# Altium schematic sheet 16. SOC MCU OSPI0 FLASH.SchDoc: SOC - MCU OSPI FLASH
size 513 x 386 mm; Project: PROC154E2(001)_SK_AM69; Issue: 1.0; RevCode: E3; Page Create Date: March  8, 1995; Variant Name: Core Design; Schematic Page Number: 16; Page Number: 16; Page Size: C; Comment: MISTRAL_TITLEBLK_CSIZE_1; Page Count: 62; Schematic Page Count: 62; Name: PROC154E2 001 SK AM69; DsnPath: C:\Users\danie\Downloads\sprr466c\PROC154E3_RP\PROC154E3_SCH.DSN; SchematicName: SCHEMATIC1; PageName: 16. SOC MCU OSPI0 FLASH; PageSize: C; TopSchematic: True
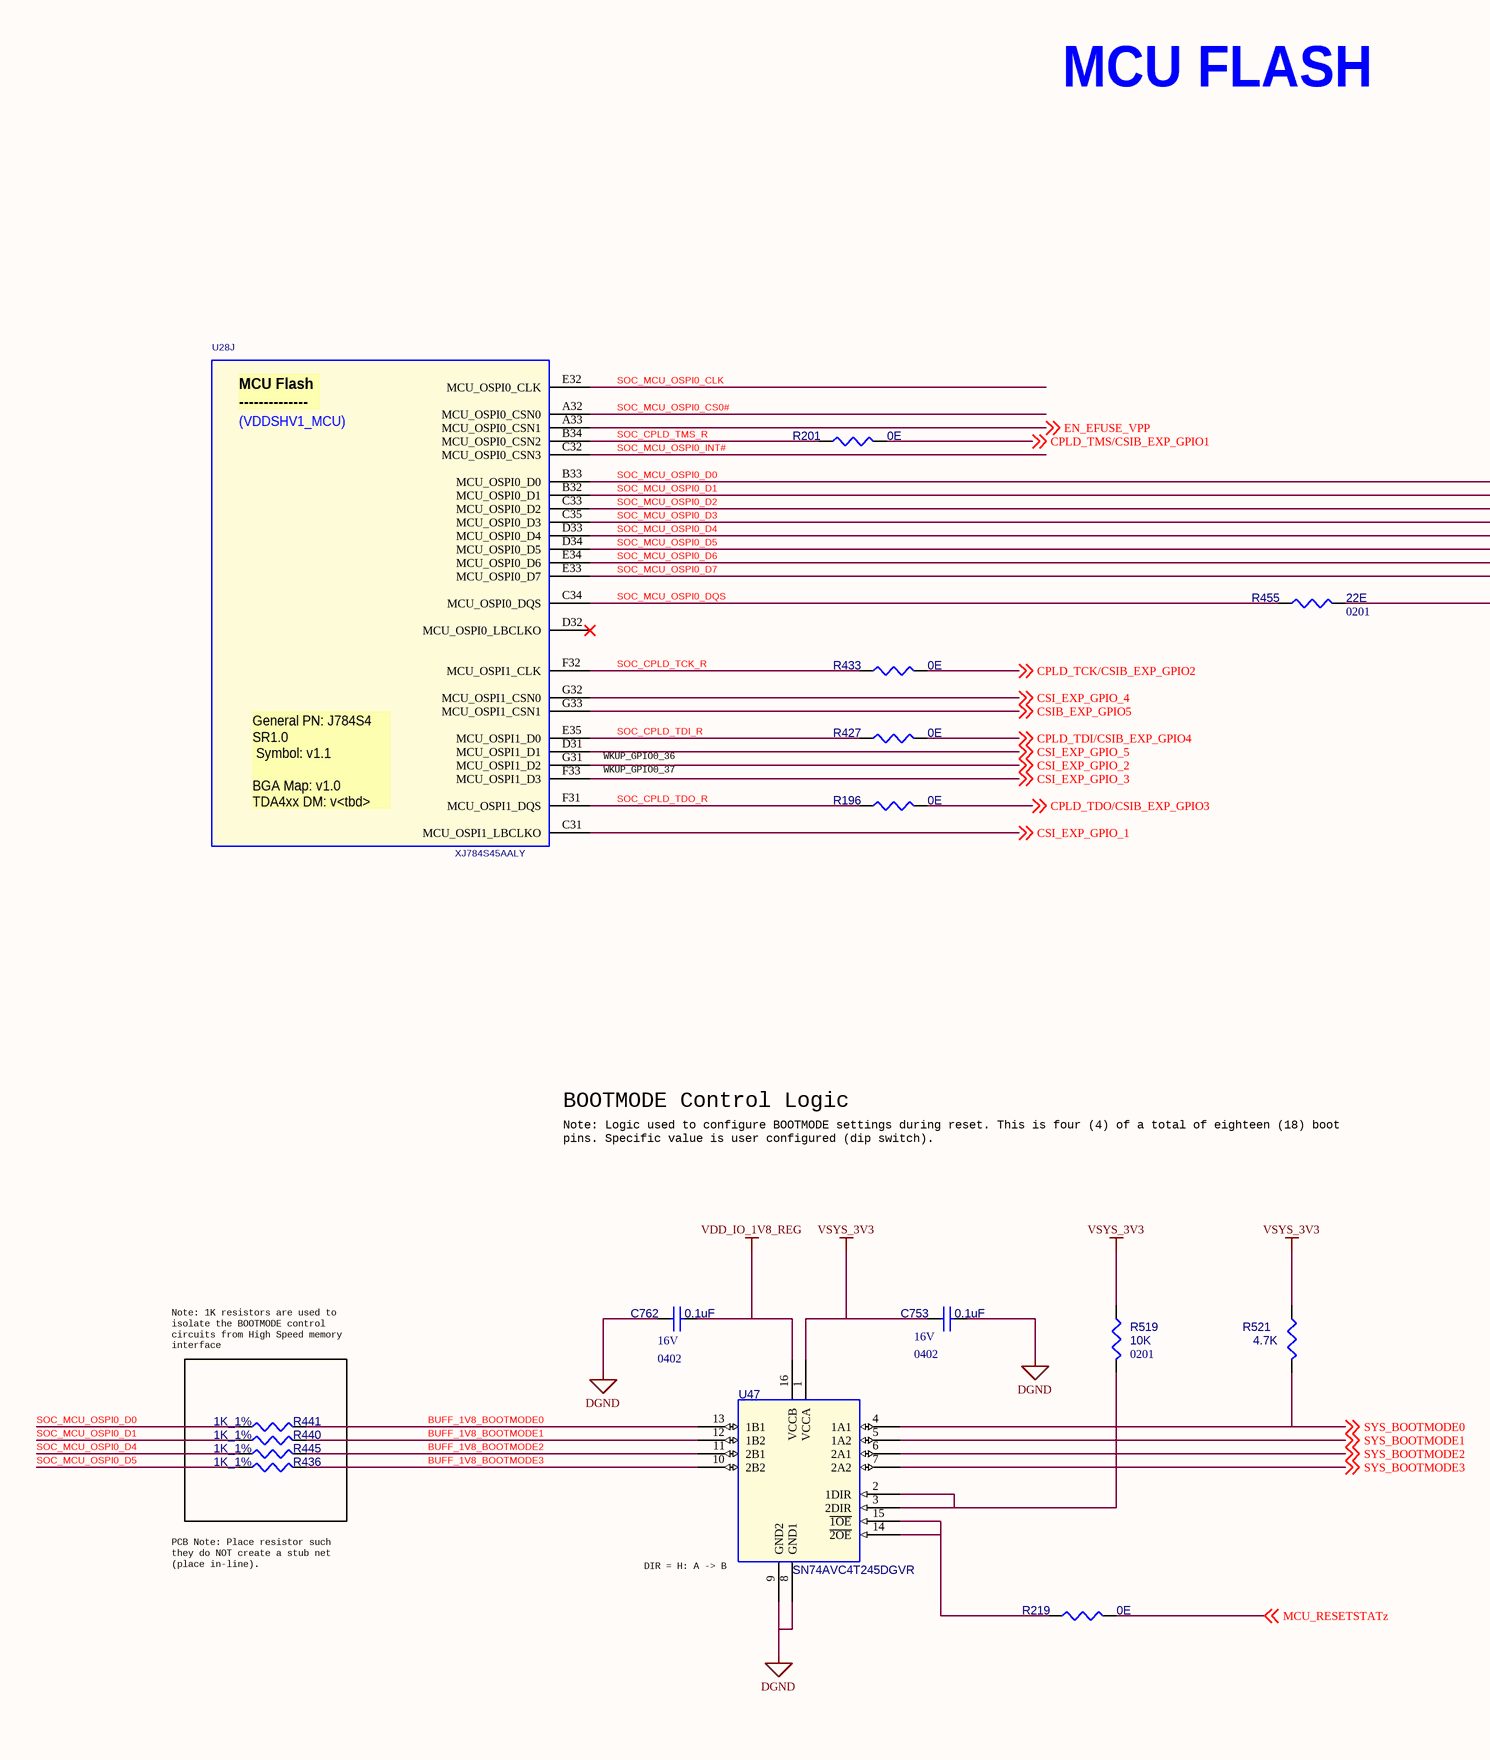
[diagram p0: 16. SOC MCU OSPI0 FLASH.SchDoc, left]
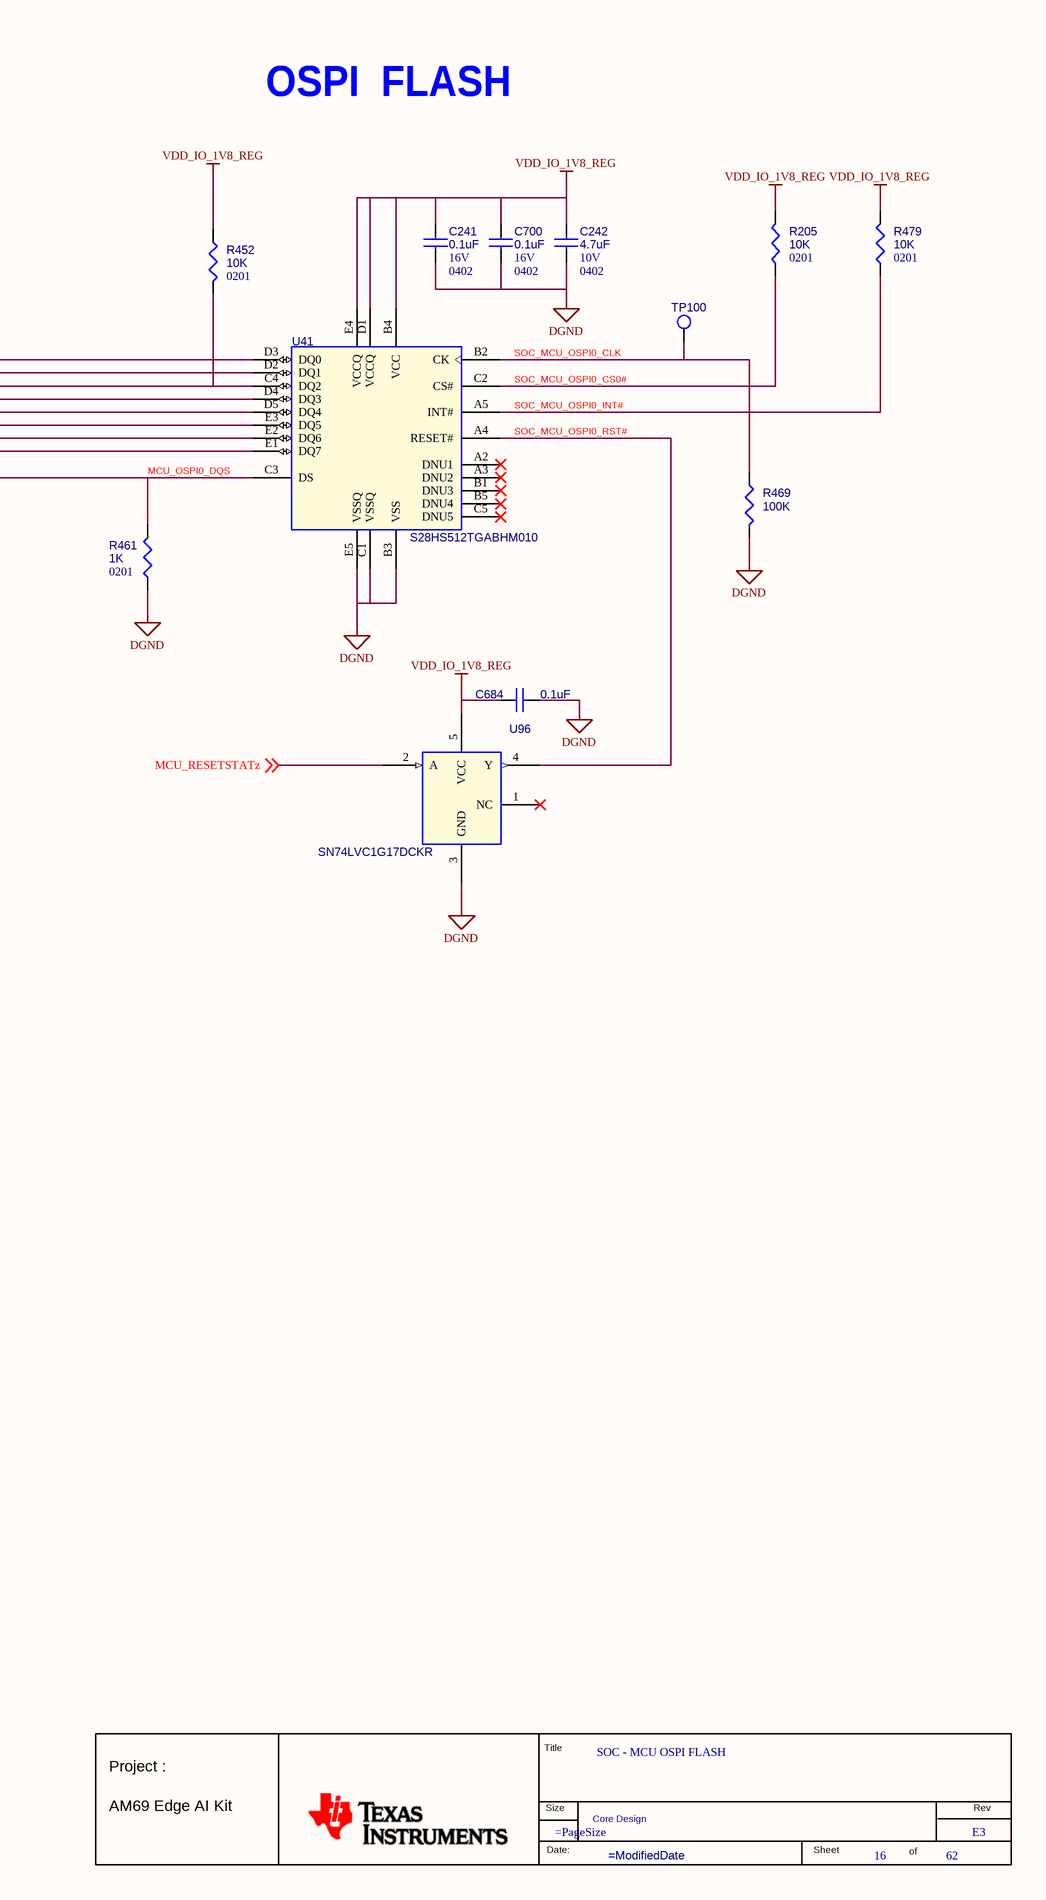
[diagram p1: 16. SOC MCU OSPI0 FLASH.SchDoc, right]

## Parts
*  RevCode: E3  Title: SOC - MCU OSPI FLASH  Page Number: 16  Page Count: 62  Variant Name: Core Design  (hidden comment: MISTRAL_TITLEBLK_CSIZE_1)  (graphical)
C241  0.1uF  Package: 0402  Voltage: 16V  [CAP0402_0-75]
C242  4.7uF  Voltage: 10V  Package: 0402  [CAP0402_0-75]
C684  0.1uF  [CAP0201_0-5]
C700  0.1uF  Voltage: 16V  Package: 0402  [CAP0402_0-75]
C753  0.1uF  Package: 0402  Voltage: 16V  [CAP0402_0-75]
C762  0.1uF  Package: 0402  Voltage: 16V  [CAP0402_0-75]
R196  0E  [RES0402_0-5]
R201  0E  [RES0402_0-5]
R205  10K  Package: 0201  [RES0201_0-5]
R219  0E  [RES0402_0-5]
R427  0E  [RES0402_0-5]
R433  0E  [RES0402_0-5]
R436  1K_1%  [RES0201_0-5]
R440  1K_1%  [RES0201_0-5]
R441  1K_1%  [RES0201_0-5]
R445  1K_1%  [RES0201_0-5]
R452  10K  Package: 0201  [RES0201_0-5]
R455  22E  Package: 0201  [RES0201_0-5]
R461  1K  Package: 0201  [RES0201_0-5]
R469  100K  [RES0402_0-5]
R479  10K  Package: 0201  [RES0201_0-5]
R519  10K  Package: 0201  [RES0201_0-5]
R521  4.7K  [RES0201_0-5]
TP100  TP30_SMD  [TP30_SMD]  (value not drawn)
U28  XJ784S45AALY  [BGA1414_31-49_1230X1230_2-7]  (part J of 26)
U41  S28HS512TGABHM010  [BGA24_39-37_240X310_1]
U47  SN74AVC4T245DGVR  [TVSOP16_15-74_150X180]
U96  SN74LVC1G17DCKR  [SC70-5]

## Nets
DGND: C241.2 C242.2 C684.2 C700.2 C753.2 C762.1 R461.1 R469.2 U41.B3(VSS) U41.C1(VSSQ) U41.E5(VSSQ) U47.8(GND1) U47.9(GND2) U96.3(GND)
VDD_IO_1V8_REG: C241.1 C242.1 C684.1 C700.1 C762.2 R205.2 R452.1 R479.2 U41.B4(VCC) U41.D1(VCCQ) U41.E4(VCCQ) U47.16(VCCB) U96.5(VCC)
VSYS_3V3: C753.1 R519.1 R521.2 U47.1(VCCA)
BUFF_1V8_BOOTMODE0: R441.1 U47.13(1B1)
BUFF_1V8_BOOTMODE1: R440.1 U47.12(1B2)
BUFF_1V8_BOOTMODE2: R445.1 U47.11(2B1)
BUFF_1V8_BOOTMODE3: R436.1 U47.10(2B2)
CPLD_TCK/CSIB_EXP_GPIO2: R433.2 ; off-sheet CPLD_TCK/CSIB_EXP_GPIO2
CPLD_TDI/CSIB_EXP_GPIO4: R427.2 ; off-sheet CPLD_TDI/CSIB_EXP_GPIO4
CPLD_TDO/CSIB_EXP_GPIO3: R196.2 ; off-sheet CPLD_TDO/CSIB_EXP_GPIO3
CPLD_TMS/CSIB_EXP_GPIO1: R201.2 ; off-sheet CPLD_TMS/CSIB_EXP_GPIO1
CSI_EXP_GPIO_1: U28.C31(MCU_OSPI1_LBCLKO) ; off-sheet CSI_EXP_GPIO_1
CSI_EXP_GPIO_2: U28.G31(MCU_OSPI1_D2) ; off-sheet CSI_EXP_GPIO_2
CSI_EXP_GPIO_3: U28.F33(MCU_OSPI1_D3) ; off-sheet CSI_EXP_GPIO_3
CSI_EXP_GPIO_4: U28.G32(MCU_OSPI1_CSN0) ; off-sheet CSI_EXP_GPIO_4
CSI_EXP_GPIO_5: U28.D31(MCU_OSPI1_D1) ; off-sheet CSI_EXP_GPIO_5
CSIB_EXP_GPIO5: U28.G33(MCU_OSPI1_CSN1) ; off-sheet CSIB_EXP_GPIO5
EN_EFUSE_VPP: U28.A33(MCU_OSPI0_CSN1) ; off-sheet EN_EFUSE_VPP
MCU_OSPI0_DQS: R455.2 R461.2 U41.C3(DS)
MCU_RESETSTATz: R219.2 U96.2(A) ; off-sheet MCU_RESETSTATz
SOC_CPLD_TCK_R: R433.1 U28.F32(MCU_OSPI1_CLK)
SOC_CPLD_TDI_R: R427.1 U28.E35(MCU_OSPI1_D0)
SOC_CPLD_TDO_R: R196.1 U28.F31(MCU_OSPI1_DQS)
SOC_CPLD_TMS_R: R201.1 U28.B34(MCU_OSPI0_CSN2)
SOC_MCU_OSPI0_CLK: R469.1 TP100.1(TP) U28.E32(MCU_OSPI0_CLK) U41.B2(CK)
SOC_MCU_OSPI0_CS0#: R205.1 U28.A32(MCU_OSPI0_CSN0) U41.C2(CS#)
SOC_MCU_OSPI0_D0: R441.2 U28.B33(MCU_OSPI0_D0) U41.D3(DQ0)
SOC_MCU_OSPI0_D1: R440.2 U28.B32(MCU_OSPI0_D1) U41.D2(DQ1)
SOC_MCU_OSPI0_D2: R452.2 U28.C33(MCU_OSPI0_D2) U41.C4(DQ2)
SOC_MCU_OSPI0_D3: U28.C35(MCU_OSPI0_D3) U41.D4(DQ3)
SOC_MCU_OSPI0_D4: R445.2 U28.D33(MCU_OSPI0_D4) U41.D5(DQ4)
SOC_MCU_OSPI0_D5: R436.2 U28.D34(MCU_OSPI0_D5) U41.E3(DQ5)
SOC_MCU_OSPI0_D6: U28.E34(MCU_OSPI0_D6) U41.E2(DQ6)
SOC_MCU_OSPI0_D7: U28.E33(MCU_OSPI0_D7) U41.E1(DQ7)
SOC_MCU_OSPI0_DQS: R455.1 U28.C34(MCU_OSPI0_DQS)
SOC_MCU_OSPI0_INT#: R479.1 U28.C32(MCU_OSPI0_CSN3) U41.A5(INT#)
SOC_MCU_OSPI0_RST#: U41.A4(RESET#) U96.4(Y)
SYS_BOOTMODE0: R521.1 U47.4(1A1) ; off-sheet SYS_BOOTMODE0
SYS_BOOTMODE1: U47.5(1A2) ; off-sheet SYS_BOOTMODE1
SYS_BOOTMODE2: U47.6(2A1) ; off-sheet SYS_BOOTMODE2
SYS_BOOTMODE3: U47.7(2A2) ; off-sheet SYS_BOOTMODE3
NetR219_1: R219.1 U47.14(~{2OE}) U47.15(~{1OE})
NetR519_2: R519.2 U47.2(1DIR) U47.3(2DIR)

Not connected (* = marked no-connect by the designer): U28 D32(MCU_OSPI0_LBCLKO)*; U41 A2(DNU1)* A3(DNU2)* B1(DNU3)* B5(DNU4)* C5(DNU5)*; U96 1(NC)*

## Notes on the sheet
- MCU FLASH
- OSPI  FLASH
- WKUP_GPIO0_36
- WKUP_GPIO0_37
- BOOTMODE Control Logic
- Note: Logic used to configure BOOTMODE settings during reset. This is four (4) of a total of eighteen (18) boot
  pins. Specific value is user configured (dip switch).
- Note: 1K resistors are used to
  isolate the BOOTMODE control
  circuits from High Speed memory
  interface
- PCB Note: Place resistor such
  they do NOT create a stub net
  (place in-line).
- (near U47) DIR = H: A -> B
- (in symbol J7AHPSoC-EVM_BGA1414, part J) MCU Flash / --------------; (VDDSHV1_MCU); General PN: J784S4 / SR1.0 / Symbol: v1.1 / BGA Map: v1.0 / TDA4xx DM: v<tbd>
- (in symbol MISTRAL_TITLEBLK_CSIZE_1) Title; Project :; Size; Rev; AM69 Edge AI Kit; Date:; Sheet; of

## Library data of the parts
* = MISTRAL_TITLEBLK_CSIZE_1: Issue: 1.0; Project: PROC154E2(001)_SK_AM69; Name: PROC154E2 001 SK AM69; Page Create Date: March  8, 1995; Page Size: =PageSize; Page Modify Date: =ModifiedDate; Schematic Page Count: 62; Schematic Page Number: 16
C241 = CAP_Dup1: CAP CERAMIC 0.1uF 16V 10% X7R AUTO 0402; Part Reference: C241; Part_type: CAPACITORS\CERAMIC; Mfr_part_number: GCM155R71C104KA55D; Mfr_name: MURATA; Mistral Part No: 120016070006-R; Direct Alternate_mfr_part_number: GCM155R71C104JA55D; Automotive Alternate_mfr_name: TDK; Automotive Alternate_mfr_part_number: CGA2B1X7R1C104K050BC; Custom_Duty: 15%; Customs_HS_Code: 85322990; Wattage: NA; Project: DCMIST_FPGA_CARD; Value: 0.1uF; MECHANICAL 3D STEP FILE: CAP0402_0-75; Footprint Path: Y:\MIS_DATABASE\Library\ALTIUM_TOOL\PCB_FOOTPRINTS\Altium_Footprint_Lib.PcbLib; Library Path: Y:\MIS_DATABASE\Library\ALTIUM_TOOL\SCHEMATICS_PARTS\MS_DISCRETE_Library.schlib; Footprint Ref: CAP0402_0-75; Library Ref: CAP; Chkd/date: NAVEED/021014; Crtd /date: VASANTHA/300514; Datasheet: Y:\MIS_DATABASE\DATASHEETS\CAPACITORS\MURATA-GCM-SER.PDF; Temperature: -55°C+125°C; Weight: 6mg; Height: 0.55MM; Distributor_part_number: 490-4759-1-ND; Distributor_name: DIGIKEY; Tolerance: 10%; Direct Alternate_mfr_name: MURATA; PCB Footprint: CAP0402_0-75
C242 = CAP_Dup1: CAP CERAMIC 4.7uF 10V 20% X5R AUTO 0402; Part Reference: C242; Mistral Part No: 120021020032-R; Mfr_name: MURATA; Mfr_part_number: GRT155R61A475ME13D; Part_type: CAPACITORS\CERAMIC; Project: TI_DRA821 SK EVM BRD; Wattage: NA; Customs_HS_Code: 85322990; Custom_Duty: 15%; Value: 4.7uF; Footprint Path: Y:\MIS_DATABASE\Library\ALTIUM_TOOL\PCB_FOOTPRINTS\Altium_Footprint_Lib.PcbLib; Library Path: Y:\MIS_DATABASE\Library\ALTIUM_TOOL\SCHEMATICS_PARTS\MS_DISCRETE_Library.schlib; Footprint Ref: CAP0402_0-75; Tolerance: 20%; Distributor_name: MOUSER; Distributor_part_number: 81-GRT155R61A475ME13; Height: 0.65MM; Weight: 1.5mg; Temperature: -55°C+85°C; Datasheet: Y:\MIS_DATABASE\DATASHEETS\CAPACITORS\GRT155R61A475ME13.PDF; Crtd /date: ALVY/240221; Chkd/date: MANIRAJA/250221; MECHANICAL 3D STEP FILE: CAP0402_0-75; Library Ref: CAP; PCB Footprint: CAP0402_0-75
C684 = CAP_Dup1: CAP CERAMIC 0.1uF 16V 10% X7S AUTO 0201; Part Reference: C684; Mistral Part No: 120021030007-R; Mfr_name: MURATA; Mfr_part_number: GRT033C71C104KE01D; Part_type: CAPACITORS\CERAMIC; Project: J7ES_SK_BRD; Wattage: NA; Customs_HS_Code: 85322990; Custom_Duty: 15%; Value: 0.1uF; Tolerance: 10%; Voltage: 16V; Package: 0201; Distributor_name: DIGIKEY; Distributor_part_number: 490-GRT033C71C104KE01DTR-ND; Height: 0.33MM; Weight: 330mg; Temperature: -55°C+125°C; Datasheet: Y:\MIS_DATABASE\DATASHEETS\CAPACITORS\GRT033C71C104KE01.PDF; Crtd /date: ALVY/110321; Chkd/date: MANIRAJA/110321; MECHANICAL 3D STEP FILE: CAP0201_0-5; PCB Footprint: CAP0201_0-5
C700 = CAP_Dup1: CAP CERAMIC 0.1uF 16V 10% X7R AUTO 0402; Part Reference: C700; Mistral Part No: 120016070006-R; Mfr_name: MURATA; Mfr_part_number: GCM155R71C104KA55D; Part_type: CAPACITORS\CERAMIC; Direct Alternate_mfr_part_number: GCM155R71C104JA55D; Automotive Alternate_mfr_name: TDK; Automotive Alternate_mfr_part_number: CGA2B1X7R1C104K050BC; Project: DCMIST_FPGA_CARD; Wattage: NA; Customs_HS_Code: 85322990; Custom_Duty: 15%; Value: 0.1uF; MECHANICAL 3D STEP FILE: CAP0402_0-75; Tolerance: 10%; Distributor_name: DIGIKEY; Distributor_part_number: 490-4759-1-ND; Height: 0.55MM; Weight: 6mg; Temperature: -55°C+125°C; Datasheet: Y:\MIS_DATABASE\DATASHEETS\CAPACITORS\MURATA-GCM-SER.PDF; Crtd /date: VASANTHA/300514; Chkd/date: NAVEED/021014; Library Ref: CAP; Footprint Ref: CAP0402_0-75; Library Path: Y:\MIS_DATABASE\Library\ALTIUM_TOOL\SCHEMATICS_PARTS\MS_DISCRETE_Library.schlib; Footprint Path: Y:\MIS_DATABASE\Library\ALTIUM_TOOL\PCB_FOOTPRINTS\Altium_Footprint_Lib.PcbLib; Direct Alternate_mfr_name: MURATA; PCB Footprint: CAP0402_0-75
C753 = CAP_Dup1: CAP CERAMIC 0.1uF 16V 10% X7R AUTO 0402; Part Reference: C753; Automotive Alternate_mfr_part_number: CGA2B1X7R1C104K050BC; Automotive Alternate_mfr_name: TDK; Direct Alternate_mfr_part_number: GCM155R71C104JA55D; Direct Alternate_mfr_name: MURATA; Part_type: CAPACITORS\CERAMIC; Mfr_part_number: GCM155R71C104KA55D; Mistral Part No: 120016070006-R; Custom_Duty: 15%; Customs_HS_Code: 85322990; Wattage: NA; Project: DCMIST_FPGA_CARD; Value: 0.1uF; Footprint Path: Y:\MIS_DATABASE\Library\ALTIUM_TOOL\PCB_FOOTPRINTS\Altium_Footprint_Lib.PcbLib; Library Path: Y:\MIS_DATABASE\Library\ALTIUM_TOOL\SCHEMATICS_PARTS\MS_DISCRETE_Library.schlib; Footprint Ref: CAP0402_0-75; Library Ref: CAP; Chkd/date: NAVEED/021014; Crtd /date: VASANTHA/300514; Datasheet: Y:\MIS_DATABASE\DATASHEETS\CAPACITORS\MURATA-GCM-SER.PDF; Temperature: -55°C+125°C; Weight: 6mg; Height: 0.55MM; Distributor_part_number: 490-4759-1-ND; Distributor_name: DIGIKEY; Tolerance: 10%; Mfr_name: MURATA; MECHANICAL 3D STEP FILE: CAP0402_0-75; PCB Footprint: CAP0402_0-75
C762 = CAP_Dup1: CAP CERAMIC 0.1uF 16V 10% X7R AUTO 0402; Part Reference: C762; Part_type: CAPACITORS\CERAMIC; Mfr_part_number: GCM155R71C104KA55D; Mfr_name: MURATA; Mistral Part No: 120016070006-R; Direct Alternate_mfr_part_number: GCM155R71C104JA55D; Automotive Alternate_mfr_name: TDK; Automotive Alternate_mfr_part_number: CGA2B1X7R1C104K050BC; Custom_Duty: 15%; Customs_HS_Code: 85322990; Wattage: NA; Project: DCMIST_FPGA_CARD; Value: 0.1uF; MECHANICAL 3D STEP FILE: CAP0402_0-75; Footprint Path: Y:\MIS_DATABASE\Library\ALTIUM_TOOL\PCB_FOOTPRINTS\Altium_Footprint_Lib.PcbLib; Library Path: Y:\MIS_DATABASE\Library\ALTIUM_TOOL\SCHEMATICS_PARTS\MS_DISCRETE_Library.schlib; Footprint Ref: CAP0402_0-75; Library Ref: CAP; Chkd/date: NAVEED/021014; Crtd /date: VASANTHA/300514; Datasheet: Y:\MIS_DATABASE\DATASHEETS\CAPACITORS\MURATA-GCM-SER.PDF; Temperature: -55°C+125°C; Weight: 6mg; Height: 0.55MM; Distributor_part_number: 490-4759-1-ND; Distributor_name: DIGIKEY; Tolerance: 10%; Direct Alternate_mfr_name: MURATA; PCB Footprint: CAP0402_0-75
R196 = RESISTOR_Dup1: RES 0E 1/10W JUMPER 0402; Part Reference: R196; Mistral Part No: 110018030052-R; Mfr_name: PANASONIC-ECG; Mfr_part_number: ERJ-2GE0R00X; Part_type: RESISTORS\FIXED; Project: AEGIS POM; Tolerance: NA; Customs_HS_Code: 85332119; Custom_Duty: 15%; Value: 0E; MECHANICAL 3D STEP FILE: RES0402_0-5; Voltage: NA; Wattage: 1/10W; Package: 0402; Distributor_name: DIGIKEY; Distributor_part_number: P0.0JCT-ND; Height: 0.40MM; Weight: 0.8mg; Temperature: -55°C+155°C; Datasheet: Y:\MIS_DATABASE\DATASHEETS\RESISTORS\PAN-ERJSER_NOV17.PDF; Crtd /date: NAVEED/201014; Chkd/date: VASANTHA/061216; Library Ref: RESISTOR; Footprint Ref: RES0402_0-5; Library Path: Y:\MIS_DATABASE\Library\ALTIUM_TOOL\SCHEMATICS_PARTS\MS_DISCRETE_Library.schlib; Footprint Path: Y:\MIS_DATABASE\Library\ALTIUM_TOOL\PCB_FOOTPRINTS\Altium_Footprint_Lib.PcbLib; PCB Footprint: RES0402_0-5
R201 = RESISTOR_Dup1: RES 0E 1/10W JUMPER 0402; Part Reference: R201; Part_type: RESISTORS\FIXED; Mfr_part_number: ERJ-2GE0R00X; Mfr_name: PANASONIC-ECG; Mistral Part No: 110018030052-R; Custom_Duty: 15%; Customs_HS_Code: 85332119; Voltage: NA; Project: AEGIS POM; Value: 0E; Footprint Path: Y:\MIS_DATABASE\Library\ALTIUM_TOOL\PCB_FOOTPRINTS\Altium_Footprint_Lib.PcbLib; Library Path: Y:\MIS_DATABASE\Library\ALTIUM_TOOL\SCHEMATICS_PARTS\MS_DISCRETE_Library.schlib; Footprint Ref: RES0402_0-5; Library Ref: RESISTOR; Chkd/date: VASANTHA/061216; Crtd /date: NAVEED/201014; Datasheet: Y:\MIS_DATABASE\DATASHEETS\RESISTORS\PAN-ERJSER_NOV17.PDF; Temperature: -55°C+155°C; Weight: 0.8mg; Height: 0.40MM; Distributor_part_number: P0.0JCT-ND; Distributor_name: DIGIKEY; Package: 0402; Wattage: 1/10W; Tolerance: NA; MECHANICAL 3D STEP FILE: RES0402_0-5; PCB Footprint: RES0402_0-5
R205 = RESISTOR_Dup2: RES 10K 1/20W 5% 0201; Part Reference: R205; Mistral Part No: 110010070051-R; Mfr_name: YAGEO AMERICA; Mfr_part_number: RC0201JR-0710KL; Part_type: RESISTORS\FIXED; Project: GOLDEN-I LITE; Voltage: NA; Customs_HS_Code: 85332119; Custom_Duty: 15%; Value: 10K; Tolerance: 5%; Wattage: 1/20W; Distributor_name: DIGIKEY; Distributor_part_number: 311-10KNCT-ND; Height: 0.26MM; Weight: 0.17mg; Temperature: -55°C+125°C; Datasheet: Y:\MIS_DATABASE\DATASHEETS\RESISTORS\RCXXXXL-SER_MAR18.PDF; Crtd /date: MANIRAJA/050517; Chkd/date: MANIRAJA/050517; MECHANICAL 3D STEP FILE: RES0201_0-5; Library Ref: RESISTOR; Footprint Ref: RES0201_0-5; Library Path: Y:\MIS_DATABASE\Library\ALTIUM_TOOL\SCHEMATICS_PARTS\MS_DISCRETE_Library.schlib; Footprint Path: Y:\MIS_DATABASE\Library\ALTIUM_TOOL\PCB_FOOTPRINTS\Altium_Footprint_Lib.PcbLib; PCB Footprint: RES0201_0-5
R219 = RESISTOR_Dup1: RES 0E 1/10W JUMPER 0402; Part Reference: R219; Mistral Part No: 110018030052-R; Mfr_name: PANASONIC-ECG; Mfr_part_number: ERJ-2GE0R00X; Part_type: RESISTORS\FIXED; Project: AEGIS POM; Tolerance: NA; Customs_HS_Code: 85332119; Custom_Duty: 15%; Value: 0E; MECHANICAL 3D STEP FILE: RES0402_0-5; Voltage: NA; Wattage: 1/10W; Package: 0402; Distributor_name: DIGIKEY; Distributor_part_number: P0.0JCT-ND; Height: 0.40MM; Weight: 0.8mg; Temperature: -55°C+155°C; Datasheet: Y:\MIS_DATABASE\DATASHEETS\RESISTORS\PAN-ERJSER_NOV17.PDF; Crtd /date: NAVEED/201014; Chkd/date: VASANTHA/061216; Library Ref: RESISTOR; Footprint Ref: RES0402_0-5; Library Path: Y:\MIS_DATABASE\Library\ALTIUM_TOOL\SCHEMATICS_PARTS\MS_DISCRETE_Library.schlib; Footprint Path: Y:\MIS_DATABASE\Library\ALTIUM_TOOL\PCB_FOOTPRINTS\Altium_Footprint_Lib.PcbLib; PCB Footprint: RES0402_0-5
R427 = RESISTOR_Dup1: RES 0E 1/10W JUMPER 0402; Part Reference: R427; Mistral Part No: 110018030052-R; Mfr_name: PANASONIC-ECG; Mfr_part_number: ERJ-2GE0R00X; Part_type: RESISTORS\FIXED; Project: AEGIS POM; Tolerance: NA; Customs_HS_Code: 85332119; Custom_Duty: 15%; Value: 0E; MECHANICAL 3D STEP FILE: RES0402_0-5; Voltage: NA; Wattage: 1/10W; Package: 0402; Distributor_name: DIGIKEY; Distributor_part_number: P0.0JCT-ND; Height: 0.40MM; Weight: 0.8mg; Temperature: -55°C+155°C; Datasheet: Y:\MIS_DATABASE\DATASHEETS\RESISTORS\PAN-ERJSER_NOV17.PDF; Crtd /date: NAVEED/201014; Chkd/date: VASANTHA/061216; Library Ref: RESISTOR; Footprint Ref: RES0402_0-5; Library Path: Y:\MIS_DATABASE\Library\ALTIUM_TOOL\SCHEMATICS_PARTS\MS_DISCRETE_Library.schlib; Footprint Path: Y:\MIS_DATABASE\Library\ALTIUM_TOOL\PCB_FOOTPRINTS\Altium_Footprint_Lib.PcbLib; PCB Footprint: RES0402_0-5
R433 = RESISTOR_Dup1: RES 0E 1/10W JUMPER 0402; Part Reference: R433; Part_type: RESISTORS\FIXED; Mfr_part_number: ERJ-2GE0R00X; Mfr_name: PANASONIC-ECG; Mistral Part No: 110018030052-R; Custom_Duty: 15%; Customs_HS_Code: 85332119; Voltage: NA; Project: AEGIS POM; Value: 0E; Footprint Path: Y:\MIS_DATABASE\Library\ALTIUM_TOOL\PCB_FOOTPRINTS\Altium_Footprint_Lib.PcbLib; Library Path: Y:\MIS_DATABASE\Library\ALTIUM_TOOL\SCHEMATICS_PARTS\MS_DISCRETE_Library.schlib; Footprint Ref: RES0402_0-5; Library Ref: RESISTOR; Chkd/date: VASANTHA/061216; Crtd /date: NAVEED/201014; Datasheet: Y:\MIS_DATABASE\DATASHEETS\RESISTORS\PAN-ERJSER_NOV17.PDF; Temperature: -55°C+155°C; Weight: 0.8mg; Height: 0.40MM; Distributor_part_number: P0.0JCT-ND; Distributor_name: DIGIKEY; Package: 0402; Wattage: 1/10W; Tolerance: NA; MECHANICAL 3D STEP FILE: RES0402_0-5; PCB Footprint: RES0402_0-5
R436 = RESISTOR_Dup1: RES 1K 1/20W 1% 0201; Part Reference: R436; Mistral Part No: 110015080014-R; Mfr_name: KOA SPEER; Mfr_part_number: RK73H1HTTC1001F; Part_type: RESISTORS\FIXED; Voltage: NA; Project: HMC; Customs_HS_Code: 85332119; Custom_Duty: 15%; Value: 1K_1%; Footprint Path: Y:\MIS_DATABASE\Library\ALTIUM_TOOL\PCB_FOOTPRINTS\Altium_Footprint_Lib.PcbLib; Library Path: Y:\MIS_DATABASE\Library\ALTIUM_TOOL\SCHEMATICS_PARTS\MS_DISCRETE_Library.schlib; MECHANICAL 3D STEP FILE: RES0201_0-5; Footprint Ref: RES0201_0-5; Tolerance: 1%; Wattage: 1/20W; Package: 0201; Distributor_name: MOUSER; Distributor_part_number: 660-RK73H1HTTC1001F; Height: 0.26MM; Weight: 0.17mg; Temperature: -55°C+155°C; Datasheet: Y:\MIS_DATABASE\DATASHEETS\RESISTORS\RK73H-SER.PDF; Crtd /date: MAZHAR/100511; Chkd/date: RAGESH/120511; Library Ref: RESISTOR; Manufacturer: KOA SPEER; PCB Footprint: RES0201_0-5
R440 = RESISTOR_Dup1: RES 1K 1/20W 1% 0201; Part Reference: R440; Manufacturer: KOA SPEER; Part_type: RESISTORS\FIXED; Mfr_part_number: RK73H1HTTC1001F; Mistral Part No: 110015080014-R; Custom_Duty: 15%; Customs_HS_Code: 85332119; Project: HMC; Voltage: NA; Value: 1K_1%; Library Ref: RESISTOR; Chkd/date: RAGESH/120511; Crtd /date: MAZHAR/100511; Datasheet: Y:\MIS_DATABASE\DATASHEETS\RESISTORS\RK73H-SER.PDF; Temperature: -55°C+155°C; Weight: 0.17mg; Height: 0.26MM; Distributor_part_number: 660-RK73H1HTTC1001F; Distributor_name: MOUSER; Package: 0201; Wattage: 1/20W; Tolerance: 1%; Mfr_name: KOA SPEER; Footprint Ref: RES0201_0-5; MECHANICAL 3D STEP FILE: RES0201_0-5; Library Path: Y:\MIS_DATABASE\Library\ALTIUM_TOOL\SCHEMATICS_PARTS\MS_DISCRETE_Library.schlib; Footprint Path: Y:\MIS_DATABASE\Library\ALTIUM_TOOL\PCB_FOOTPRINTS\Altium_Footprint_Lib.PcbLib; PCB Footprint: RES0201_0-5
R441 = RESISTOR_Dup1: RES 1K 1/20W 1% 0201; Part Reference: R441; Manufacturer: KOA SPEER; Mistral Part No: 110015080014-R; Mfr_part_number: RK73H1HTTC1001F; Part_type: RESISTORS\FIXED; Voltage: NA; Project: HMC; Customs_HS_Code: 85332119; Custom_Duty: 15%; Value: 1K_1%; Footprint Path: Y:\MIS_DATABASE\Library\ALTIUM_TOOL\PCB_FOOTPRINTS\Altium_Footprint_Lib.PcbLib; Library Path: Y:\MIS_DATABASE\Library\ALTIUM_TOOL\SCHEMATICS_PARTS\MS_DISCRETE_Library.schlib; MECHANICAL 3D STEP FILE: RES0201_0-5; Footprint Ref: RES0201_0-5; Mfr_name: KOA SPEER; Tolerance: 1%; Wattage: 1/20W; Package: 0201; Distributor_name: MOUSER; Distributor_part_number: 660-RK73H1HTTC1001F; Height: 0.26MM; Weight: 0.17mg; Temperature: -55°C+155°C; Datasheet: Y:\MIS_DATABASE\DATASHEETS\RESISTORS\RK73H-SER.PDF; Crtd /date: MAZHAR/100511; Chkd/date: RAGESH/120511; Library Ref: RESISTOR; PCB Footprint: RES0201_0-5
R445 = RESISTOR_Dup1: RES 1K 1/20W 1% 0201; Part Reference: R445; Manufacturer: KOA SPEER; Part_type: RESISTORS\FIXED; Mfr_part_number: RK73H1HTTC1001F; Mistral Part No: 110015080014-R; Custom_Duty: 15%; Customs_HS_Code: 85332119; Project: HMC; Voltage: NA; Value: 1K_1%; Library Ref: RESISTOR; Chkd/date: RAGESH/120511; Crtd /date: MAZHAR/100511; Datasheet: Y:\MIS_DATABASE\DATASHEETS\RESISTORS\RK73H-SER.PDF; Temperature: -55°C+155°C; Weight: 0.17mg; Height: 0.26MM; Distributor_part_number: 660-RK73H1HTTC1001F; Distributor_name: MOUSER; Package: 0201; Wattage: 1/20W; Tolerance: 1%; Mfr_name: KOA SPEER; Footprint Ref: RES0201_0-5; MECHANICAL 3D STEP FILE: RES0201_0-5; Library Path: Y:\MIS_DATABASE\Library\ALTIUM_TOOL\SCHEMATICS_PARTS\MS_DISCRETE_Library.schlib; Footprint Path: Y:\MIS_DATABASE\Library\ALTIUM_TOOL\PCB_FOOTPRINTS\Altium_Footprint_Lib.PcbLib; PCB Footprint: RES0201_0-5
R452 = RESISTOR_Dup2: RES 10K 1/20W 5% 0201; Part Reference: R452; Mistral Part No: 110010070051-R; Mfr_name: YAGEO AMERICA; Mfr_part_number: RC0201JR-0710KL; Part_type: RESISTORS\FIXED; Project: GOLDEN-I LITE; Voltage: NA; Customs_HS_Code: 85332119; Custom_Duty: 15%; Value: 10K; Footprint Ref: RES0201_0-5; Tolerance: 5%; Wattage: 1/20W; Distributor_name: DIGIKEY; Distributor_part_number: 311-10KNCT-ND; Library Ref: RESISTOR; Height: 0.26MM; Weight: 0.17mg; Temperature: -55°C+125°C; Datasheet: Y:\MIS_DATABASE\DATASHEETS\RESISTORS\RCXXXXL-SER_MAR18.PDF; Crtd /date: MANIRAJA/050517; Chkd/date: MANIRAJA/050517; MECHANICAL 3D STEP FILE: RES0201_0-5; Library Path: Y:\MIS_DATABASE\Library\ALTIUM_TOOL\SCHEMATICS_PARTS\MS_DISCRETE_Library.schlib; Footprint Path: Y:\MIS_DATABASE\Library\ALTIUM_TOOL\PCB_FOOTPRINTS\Altium_Footprint_Lib.PcbLib; PCB Footprint: RES0201_0-5
R455 = RESISTOR_Dup2: RES 22E 1/20W 5% 0201; Part Reference: R455; Mistral Part No: 110020050041-R; Mfr_name: PANASONIC-ECG; Mfr_part_number: ERJ-1GNJ220C; Part_type: RESISTORS\FIXED; Project: QCS610_NANOSOM; Voltage: NA; Customs_HS_Code: 85332119; Custom_Duty: 15%; SIGNAL_MODEL: RESISTOR_RES0201_0-5_22E_22E; Value: 22E; Footprint Ref: RES0201_0-5; Tolerance: 5%; Wattage: 1/20W; Distributor_name: DIGIKEY; Distributor_part_number: P123275CT-ND; Library Ref: RESISTOR; Height: 0.26MM; Weight: 0.15mg; Temperature: -55°C+125°C; Datasheet: Y:\MIS_DATABASE\DATASHEETS\RESISTORS\PAN-ERJSER_NOV17.PDF; Crtd /date: ALVY/250520; Chkd/date: MANIRAJA/300520; MECHANICAL 3D STEP FILE: RES0201_0-5; Library Path: Y:\MIS_DATABASE\Library\ALTIUM_TOOL\SCHEMATICS_PARTS\MS_DISCRETE_Library.schlib; Footprint Path: Y:\MIS_DATABASE\Library\ALTIUM_TOOL\PCB_FOOTPRINTS\Altium_Footprint_Lib.PcbLib; PCB Footprint: RES0201_0-5
R461 = RESISTOR_Dup1: RES 1K 1/20W 5% 0201; Part Reference: R461; Part_type: RESISTORS\FIXED; Mfr_part_number: RC0201JR-071KL; Mfr_name: YAGEO AMERICA; Mistral Part No: 110009030395-R; Custom_Duty: 15%; Customs_HS_Code: 85332119; Project: GOLDEN-I LITE; Voltage: NA; Value: 1K; Library Ref: RESISTOR; Chkd/date: MANIRAJA/050517; Crtd /date: MANIRAJA/050517; Datasheet: Y:\MIS_DATABASE\DATASHEETS\RESISTORS\RCXXXXL-SER_MAR18.PDF; Temperature: -55°C+125°C; Weight: 0.17mg; Height: 0.26MM; Distributor_part_number: 311-1KNCT-ND; Distributor_name: DIGIKEY; Wattage: 1/20W; Tolerance: 5%; Footprint Ref: RES0201_0-5; MECHANICAL 3D STEP FILE: RES0201_0-5; Library Path: Y:\MIS_DATABASE\Library\ALTIUM_TOOL\SCHEMATICS_PARTS\MS_DISCRETE_Library.schlib; Footprint Path: Y:\MIS_DATABASE\Library\ALTIUM_TOOL\PCB_FOOTPRINTS\Altium_Footprint_Lib.PcbLib; PCB Footprint: RES0201_0-5
R469 = RESISTOR_Dup2: RES 100K 1/10W 5% 0402; Part Reference: R469; Mistral Part No: 110009030177-R; Mfr_name: PANASONIC-ECG; Mfr_part_number: ERJ-2GEJ104X; Part_type: RESISTORS\FIXED; Project: RED EYE; Voltage: NA; Customs_HS_Code: 85332119; Custom_Duty: 15%; Value: 100K; Footprint Ref: RES0402_0-5; Tolerance: 5%; Wattage: 1/10W; Package: 0402; Distributor_name: DIGIKEY; Distributor_part_number: P100KJCT-ND; Library Ref: RESISTOR; Height: 0.40MM; Weight: 0.8mg; Temperature: -55°C+155°C; Datasheet: Y:\MIS_DATABASE\DATASHEETS\RESISTORS\PAN-ERJSER_NOV17.PDF; Crtd /date: GEETHA/190406; Chkd/date: VASANTHA/291216; MECHANICAL 3D STEP FILE: RES0402_0-5; Library Path: Y:\MIS_DATABASE\Library\ALTIUM_TOOL\SCHEMATICS_PARTS\MS_DISCRETE_Library.schlib; Footprint Path: Y:\MIS_DATABASE\Library\ALTIUM_TOOL\PCB_FOOTPRINTS\Altium_Footprint_Lib.PcbLib; PCB Footprint: RES0402_0-5
R479 = RESISTOR_Dup2: RES 10K 1/20W 5% 0201; Part Reference: R479; Part_type: RESISTORS\FIXED; Mfr_part_number: RC0201JR-0710KL; Mfr_name: YAGEO AMERICA; Mistral Part No: 110010070051-R; Custom_Duty: 15%; Customs_HS_Code: 85332119; Voltage: NA; Project: GOLDEN-I LITE; Value: 10K; Footprint Path: Y:\MIS_DATABASE\Library\ALTIUM_TOOL\PCB_FOOTPRINTS\Altium_Footprint_Lib.PcbLib; Library Path: Y:\MIS_DATABASE\Library\ALTIUM_TOOL\SCHEMATICS_PARTS\MS_DISCRETE_Library.schlib; Footprint Ref: RES0201_0-5; Library Ref: RESISTOR; MECHANICAL 3D STEP FILE: RES0201_0-5; Chkd/date: MANIRAJA/050517; Crtd /date: MANIRAJA/050517; Datasheet: Y:\MIS_DATABASE\DATASHEETS\RESISTORS\RCXXXXL-SER_MAR18.PDF; Temperature: -55°C+125°C; Weight: 0.17mg; Height: 0.26MM; Distributor_part_number: 311-10KNCT-ND; Distributor_name: DIGIKEY; Wattage: 1/20W; Tolerance: 5%; PCB Footprint: RES0201_0-5
R519 = RESISTOR_Dup2: RES 10K 1/20W 5% 0201; Part Reference: R519; Part_type: RESISTORS\FIXED; Mfr_part_number: RC0201JR-0710KL; Mfr_name: YAGEO AMERICA; Mistral Part No: 110010070051-R; Custom_Duty: 15%; Customs_HS_Code: 85332119; Voltage: NA; Project: GOLDEN-I LITE; Value: 10K; Footprint Path: Y:\MIS_DATABASE\Library\ALTIUM_TOOL\PCB_FOOTPRINTS\Altium_Footprint_Lib.PcbLib; Library Path: Y:\MIS_DATABASE\Library\ALTIUM_TOOL\SCHEMATICS_PARTS\MS_DISCRETE_Library.schlib; MECHANICAL 3D STEP FILE: RES0201_0-5; Chkd/date: MANIRAJA/050517; Crtd /date: MANIRAJA/050517; Datasheet: Y:\MIS_DATABASE\DATASHEETS\RESISTORS\RCXXXXL-SER_MAR18.PDF; Temperature: -55°C+125°C; Weight: 0.17mg; Height: 0.26MM; Library Ref: RESISTOR; Distributor_part_number: 311-10KNCT-ND; Distributor_name: DIGIKEY; Wattage: 1/20W; Tolerance: 5%; Footprint Ref: RES0201_0-5; PCB Footprint: RES0201_0-5
R521 = RESISTOR_Dup2: RES 4.7K 1/20W 5% 0201; Part Reference: R521; Part_type: RESISTORS\FIXED; Mfr_part_number: ERJ-1GNJ472C; Mfr_name: PANASONIC-ECG; Mistral Part No: 110010070061-R; Custom_Duty: 15%; Customs_HS_Code: 85332119; Voltage: NA; Project: CUSTOM DCA1000; Value: 4.7K; Footprint Path: Y:\MIS_DATABASE\Library\ALTIUM_TOOL\PCB_FOOTPRINTS\Altium_Footprint_Lib.PcbLib; Library Path: Y:\MIS_DATABASE\Library\ALTIUM_TOOL\SCHEMATICS_PARTS\MS_DISCRETE_Library.schlib; MECHANICAL 3D STEP FILE: RES0201_0-5; Chkd/date: MANIRAJA/170420; Crtd /date: ALVY/170420; Datasheet: Y:\MIS_DATABASE\DATASHEETS\RESISTORS\PAN-ERJSER_NOV17.PDF; Temperature: -55°C+125°C; Weight: 0.15mg; Height: 0.26MM; Library Ref: RESISTOR; Distributor_part_number: P4.7AECT-ND; Distributor_name: DIGIKEY; Package: 0201; Wattage: 1/20W; Tolerance: 5%; Footprint Ref: RES0201_0-5; PCB Footprint: RES0201_0-5
TP100 = TESTPOINT_Dup1: TESTPOINT CIR 30 SMD; Part Reference: TP100; Mfr_name: LOCAL; Mistral Part No: 130009030930; Custom_Duty: NA; Project: BT MODULE_CSRBC04; Value: TP30_SMD; Customs_HS_Code: NA; RoHS: NA; Footprint Path: Y:\MIS_DATABASE\Library\ALTIUM_TOOL\PCB_FOOTPRINTS\Altium_Footprint_Lib.PcbLib; Library Path: Y:\MIS_DATABASE\Library\ALTIUM_TOOL\SCHEMATICS_PARTS\MS_DISCRETE_Library.schlib; MECHANICAL 3D STEP FILE: NA; Chkd/date: SHREESHAIL/171006; Crtd /date: MAZHAR/171006; Datasheet: NA; Temperature: NA; Weight: NA; Height: NA; Distributor_part_number: NA; Distributor_name: NA; Package: SMD; Wattage: NA; Voltage: NA; Tolerance: NA; Part_type: TESTPOINT; Mfr_part_number: TP30_SMD; Library Ref: TESTPOINT; Footprint Ref: TP30_SMD; PCB Footprint: TP30_SMD
U28 = J7AHPSoC-EVM_BGA1414: IC AM69 SoC EVM MICROPROCESSOR BGA1414; Part Reference: U28; Part_type: ICS\DIGITAL\MICROPROCESSOR; Mfr_name: TEXAS INSTRUMENTS; Mistral Part No: 141230020002; SPLIT_INST: TRUE; SWAP_INFO: (S1+S2+S3+S4+S5+S6+S7+S8+S9+S10+S11+S12+S13+S14+S15+S16+S17+S18+S19+S20+S21+S22+S23+S24+S25+S26); Custom_Duty: 15%; Customs_HS_Code: 85423100; Wattage: NA; Project: TI_J7AHP SK_BRD; Value: XJ784S45AALY; Footprint Path: Y:\MIS_DATABASE\Library\ALTIUM_TOOL\PCB_FOOTPRINTS\Altium_Footprint_Lib.PcbLib; Library Path: Y:\MIS_DATABASE\Library\ALTIUM_TOOL\SCHEMATICS_PARTS\MS_MICROPROCESSOR_Library.schlib; MECHANICAL 3D STEP FILE: BGA1414_31-49_1230X1230_2-7; RoHS: NA; Chkd/date: MANIRAJA/151221; Crtd /date: ALVY/141221; Datasheet: Y:\MIS_DATABASE\DATASHEETS\ICS\DIGITAL\MICROCONTROLLER\J7AHP-SoC-EVM.PDF; Temperature: NA; Weight: NA; Height: 2.70MM; Library Ref: J7AHPSoC-EVM_BGA1414; Distributor_part_number: NA; Distributor_name: NA; Package: BGA1414; Voltage: NA; Tolerance: NA; Mfr_part_number: XJ784S45AALY; Footprint Ref: BGA1414_31-49_1230X1230_2-7; Manufacturer: TEXAS INSTRUMENTS; PCB Footprint: BGA1414_31-49_1230X1230_2-7
U41 = S28HS512T_BGA24: IC 1.8V 512Mb SEMPER FLASH WITH OCTAL INTERFACE BGA24; Part Reference: U41; Part_type: ICS\DIGITAL\MEMORY; Mfr_name: CYPRESS SEMICONDUCTOR; Mistral Part No: 141120010002; Custom_Duty: 15%; Customs_HS_Code: 85423100; Wattage: NA; Project: J7VCL_SOM DUAL LEO PMIC; Value: S28HS512TGABHM010; Footprint Path: Y:\MIS_DATABASE\Library\ALTIUM_TOOL\PCB_FOOTPRINTS\Altium_Footprint_Lib.PcbLib; Library Path: Y:\MIS_DATABASE\Library\ALTIUM_TOOL\SCHEMATICS_PARTS\MS_MISCMEMORY_Library.schlib; MECHANICAL 3D STEP FILE: BGA24_39-37_240X310_1; RoHS: NA; Chkd/date: MANIRAJA/170120; Crtd /date: ALVY/170120; Datasheet: Y:\MIS_DATABASE\DATASHEETS\ICS\MEMORY\S28HS512T.PDF; Temperature: -40°C+125°C; Weight: NA; Height: 1.00MM; Library Ref: S28HS512T_BGA24; Distributor_part_number: NA; Distributor_name: NA; Package: BGA24; Voltage: NA; Tolerance: NA; Mfr_part_number: S28HS512TGABHM010; Footprint Ref: BGA24_39-37_240X310_1; PCB Footprint: BGA24_39-37_240X310_1
U47 = SN74AVC4T245DGVR_TVSOP16: IC 4-BIT DUAL SUPPLY BUS TRANSCEIVER TVSOP16; Part Reference: U47; Part_type: ICS\DIGITAL\COMBINATIONAL; Mfr_name: TEXAS INSTRUMENTS; Mistral Part No: 141009110005-P; Custom_Duty: 15%; Customs_HS_Code: 85423100; Project: GOLDEN-I; Value: SN74AVC4T245DGVR; RoHS: Sb/ Br FREE; Chkd/date: SUHAS/251010; Crtd /date: MAZHAR/201109; Datasheet: Y:\MIS_DATABASE\DATASHEETS\ICS\DIGITAL\BUSTRANSCEIVER\SN74AVC4T245.PDF; Temperature: -40°C+85°C; Height: 1.20MM; Library Ref: SN74AVC4T245DGVR_TVSOP16; Distributor_part_number: 296-18054-1-ND; Distributor_name: DIGIKEY; Package: TVSOP16; Mfr_part_number: SN74AVC4T245DGVR; PCB Footprint: TVSOP16_15-74_150X180
U96 = SN74LVC1G17DCKR_SC70-5: IC SINGLE SCHMITT-TRIGGER BUFFER SC70-5; Part Reference: U96; Part_type: ICS\DIGITAL\COMBINATIONAL; Mfr_name: TEXAS INSTRUMENTS; Mistral Part No: 141010110012-R; Automotive Alternate_mfr_part_number: SN74LVC1G17QDCKRQ1; Custom_Duty: 15%; Customs_HS_Code: 85423100; Wattage: NA; Project: ITS-PWR_CARD; Value: SN74LVC1G17DCKR; Chkd/date: MAZHAR/011210; Crtd /date: BAVISH/251110; Datasheet: Y:\MIS_DATABASE\DATASHEETS\ICS\DIGITAL\COMBINATIONAL\SN74LVC1G17DCK.PDF; Temperature: -40°C+85°C; Weight: NA; Height: 1.10MM; Library Ref: SN74LVC1G17DCKR_SC70-5; Distributor_part_number: 296-11934-1-ND; Distributor_name: DIGIKEY; Package: SC70-5; Voltage: NA; Tolerance: NA; Mfr_part_number: SN74LVC1G17DCKR; Automotive Alternate_mfr_name: TEXAS INSTRUMENTS; PCB Footprint: SC70-5